# EAGLE design mkstepper (EAGLE 8.7.1)
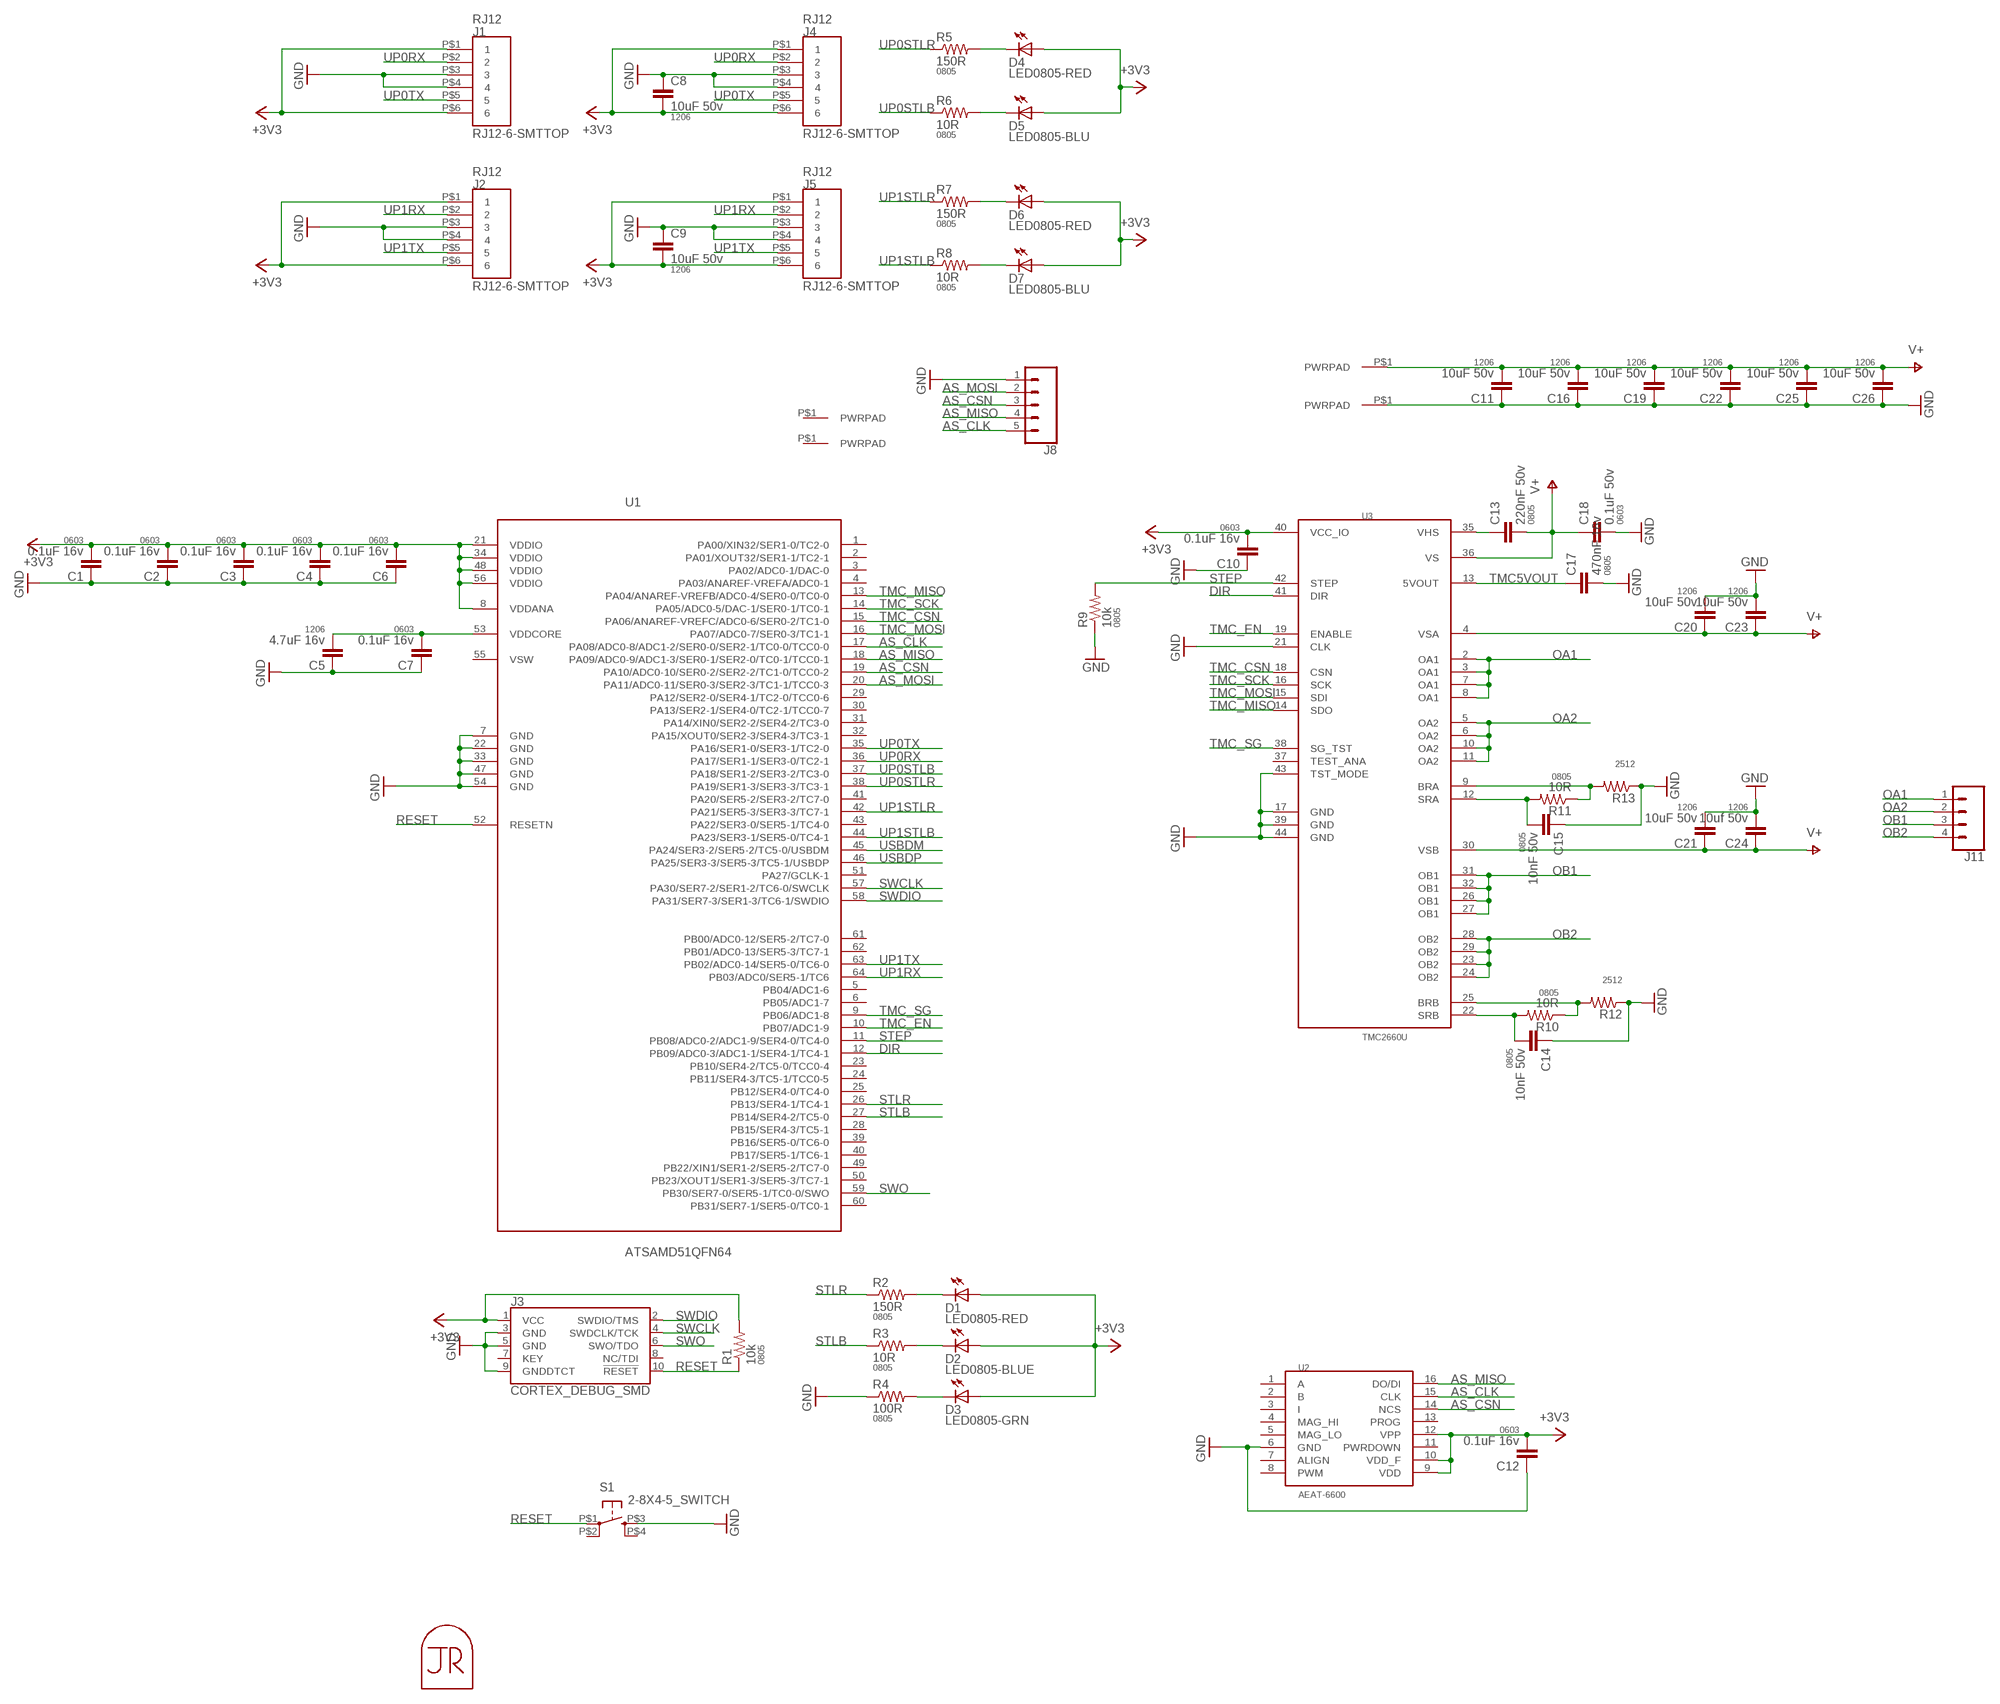
[diagram p0: schematic, sheet 1]

## Parts
C1  0.1uF 16v  CAP0603-CAP  [0603-CAP]
C2  0.1uF 16v  CAP0603-CAP  [0603-CAP]
C3  0.1uF 16v  CAP0603-CAP  [0603-CAP]
C4  0.1uF 16v  CAP0603-CAP  [0603-CAP]
C5  4.7uF 16v  CAP1206  [1206]
C6  0.1uF 16v  CAP0603-CAP  [0603-CAP]
C7  0.1uF 16v  CAP0603-CAP  [0603-CAP]
C8  10uF 50v  CAP1206  [1206]
C9  10uF 50v  CAP1206  [1206]
C10  0.1uF 16v  CAP0603-CAP  [0603-CAP]
C11  10uF 50v  CAP1206  [1206]
C12  0.1uF 16v  CAP0603-CAP  [0603-CAP]
C13  220nF 50v  CAP0805  [0805]
C14  10nF 50v  CAP0805  [0805]
C15  10nF 50v  CAP0805  [0805]
C16  10uF 50v  CAP1206  [1206]
C17  470nF 16v  CAP0805  [0805]
C18  0.1uF 50v  CAP0603-CAP  [0603-CAP]
C19  10uF 50v  CAP1206  [1206]
C20  10uF 50v  CAP1206  [1206]
C21  10uF 50v  CAP1206  [1206]
C22  10uF 50v  CAP1206  [1206]
C23  10uF 50v  CAP1206  [1206]
C24  10uf 50v  CAP1206  [1206]
C25  10uF 50v  CAP1206  [1206]
C26  10uF 50v  CAP1206  [1206]
D1  LED0805-RED  LED0805  [LED0805]
D2  LED0805-BLUE  LED0805  [LED0805]
D3  LED0805-GRN  LED0805  [LED0805]
D4  LED0805-RED  LED0805  [LED0805]
D5  LED0805-BLU  LED0805  [LED0805]
D6  LED0805-RED  LED0805  [LED0805]
D7  LED0805-BLU  LED0805  [LED0805]
J1  RJ12-6-SMTTOP  [RJ12-6-SMT-TOPENTRY]
J2  RJ12-6-SMTTOP  [RJ12-6-SMT-TOPENTRY]
J3  CORTEX_DEBUG_SMD  [SAMTECH_FTSH-105-01]
J4  RJ12-6-SMTTOP  [RJ12-6-SMT-TOPENTRY]
J5  RJ12-6-SMTTOP  [RJ12-6-SMT-TOPENTRY]
J6  PWRPADM3  [PWRPAD_3-25MM]
J7  PWRPADM3  [PWRPAD_3-25MM]
J8  CONN_05NO_SILK  [1X05_NO_SILK]
J9  PWRPAD  [PWRPAD_M3-PEM-MOUNT]
J10  PWRPAD  [PWRPAD_M3-PEM-MOUNT]
J11  CONN_04LONGPADS  [1X04_LONGPADS]
MP1  JRTOMBSTONE  [JRTOMBSTONE]
R1  10k  RESISTOR0805-RES  [0805]
R2  150R  RESISTOR0805-RES  [0805]
R3  10R  RESISTOR0805-RES  [0805]
R4  100R  RESISTOR0805-RES  [0805]
R5  150R  RESISTOR0805-RES  [0805]
R6  10R  RESISTOR0805-RES  [0805]
R7  150R  RESISTOR0805-RES  [0805]
R8  10R  RESISTOR0805-RES  [0805]
R9  10k  RESISTOR0805-RES  [0805]
R10  10R  RESISTOR0805-RES  [0805]
R11  10R  RESISTOR0805-RES  [0805]
R12  RESISTOR2512  [R2512]
R13  RESISTOR2512  [R2512]
S1  2-8X4-5_SWITCH  [TACT-SWITCH-KMR6]
U1  ATSAMD51QFN64  [QFN-64-9X9MM]
U2  AEAT-6600  [TSSOP16]
U3  TMC2660U  [TQFP44]

## Nets
+3V3: C1.2 C2.2 C3.2 C4.2 C6.2 C8.2 C9.2 C10.2 C12.2 D1.1(A) D2.1(A) D3.1(A) D4.1(A) D5.1(A) D6.1(A) D7.1(A) J1.P$1 J1.P$6 J2.P$1 J2.P$6 J3.1(VCC) J4.P$1 J4.P$6 J5.P$1 J5.P$6 R1.2 U1.8(VDDANA) U1.21(VDDIO) U1.34(VDDIO) U1.48(VDDIO) U1.56(VDDIO) U2.9(VDD) U2.10(VDD_F) U2.12(VPP) U3.40(VCC_IO)
AS_CLK: J8.5 U1.17(PA08/ADC0-8/ADC1-2/SER0-0/SER2-1/TC0-0/TCC0-0) U2.15(CLK)
AS_CSN: J8.3 U1.19(PA10/ADC0-10/SER0-2/SER2-2/TC1-0/TCC0-2) U2.14(NCS)
AS_MISO: J8.4 U1.18(PA09/ADC0-9/ADC1-3/SER0-1/SER2-0/TC0-1/TCC0-1) U2.16(DO/DI)
AS_MOSI: J8.2 U1.20(PA11/ADC0-11/SER0-3/SER2-3/TC1-1/TCC0-3)
BRA: R11.1 R13.2 U3.9(BRA)
BRB: R10.1 R12.2 U3.25(BRB)
DIR: U1.12(PB09/ADC0-3/ADC1-1/SER4-1/TC4-1) U3.41(DIR)
GND: C1.1 C2.1 C3.1 C4.1 C5.1 C6.1 C7.1 C8.1 C9.1 C10.1 C11.1 C12.1 C14.1 C15.1 C16.1 C17.2 C18.2 C19.1 C20.2 C21.2 C22.1 C23.2 C24.2 C25.1 C26.1 J1.P$3 J1.P$4 J2.P$3 J2.P$4 J3.3(GND) J3.5(GND) J3.9(GNDDTCT) J4.P$3 J4.P$4 J5.P$3 J5.P$4 J8.1 J10.P$1(PWRPAD) R4.1 R9.1 R12.1 R13.1 S1.P$3(S) U1.7(GND) U1.22(GND) U1.33(GND) U1.47(GND) U1.54(GND) U2.6(GND) U3.17(GND) U3.21(CLK) U3.39(GND) U3.43(TST_MODE) U3.44(GND)
N$1: D3.2(C) R4.2
N$2: C13.1 U3.35(VHS)
N$5: D2.2(C) R3.2
N$6: D1.2(C) R2.2
N$7: C5.2 C7.2 U1.53(VDDCORE)
N$10: D4.2(C) R5.2
N$11: D5.2(C) R6.2
N$13: D6.2(C) R7.2
N$14: D7.2(C) R8.2
OA1: J11.1 U3.2(OA1) U3.3(OA1) U3.7(OA1) U3.8(OA1)
OA2: J11.2 U3.5(OA2) U3.6(OA2) U3.10(OA2) U3.11(OA2)
OB1: J11.3 U3.26(OB1) U3.27(OB1) U3.31(OB1) U3.32(OB1)
OB2: J11.4 U3.23(OB2) U3.24(OB2) U3.28(OB2) U3.29(OB2)
RESET: J3.10(!RESET) R1.1 S1.P$1(P) U1.52(RESETN)
SRA: C15.2 R11.2 U3.12(SRA)
SRB: C14.2 R10.2 U3.22(SRB)
STEP: R9.2 U1.11(PB08/ADC0-2/ADC1-9/SER4-0/TC4-0) U3.42(STEP)
STLB: R3.1 U1.27(PB14/SER4-2/TC5-0)
STLR: R2.1 U1.26(PB13/SER4-1/TC4-1)
SWCLK: J3.4(SWDCLK/TCK) U1.57(PA30/SER7-2/SER1-2/TC6-0/SWCLK)
SWDIO: J3.2(SWDIO/TMS) U1.58(PA31/SER7-3/SER1-3/TC6-1/SWDIO)
SWO: J3.6(SWO/TDO) U1.59(PB30/SER7-0/SER5-1/TC0-0/SWO)
TMC5VOUT: C17.1 U3.13(5VOUT)
TMC_CSN: U1.15(PA06/ANAREF-VREFC/ADC0-6/SER0-2/TC1-0) U3.18(CSN)
TMC_EN: U1.10(PB07/ADC1-9) U3.19(ENABLE)
TMC_MISO: U1.13(PA04/ANAREF-VREFB/ADC0-4/SER0-0/TC0-0) U3.14(SDO)
TMC_MOSI: U1.16(PA07/ADC0-7/SER0-3/TC1-1) U3.15(SDI)
TMC_SCK: U1.14(PA05/ADC0-5/DAC-1/SER0-1/TC0-1) U3.16(SCK)
TMC_SG: U1.9(PB06/ADC1-8) U3.38(SG_TST)
UP0RX: J1.P$2 J4.P$2 U1.36(PA17/SER1-1/SER3-0/TC2-1)
UP0STLB: R6.1 U1.37(PA18/SER1-2/SER3-2/TC3-0)
UP0STLR: R5.1 U1.38(PA19/SER1-3/SER3-3/TC3-1)
UP0TX: J1.P$5 J4.P$5 U1.35(PA16/SER1-0/SER3-1/TC2-0)
UP1RX: J2.P$2 J5.P$2 U1.64(PB03/ADC0/SER5-1/TC6)
UP1STLB: R8.1 U1.44(PA23/SER3-1/SER5-0/TC4-1)
UP1STLR: R7.1 U1.42(PA21/SER5-3/SER3-3/TC7-1)
UP1TX: J2.P$5 J5.P$5 U1.63(PB02/ADC0-14/SER5-0/TC6-0)
USBDM: U1.45(PA24/SER3-2/SER5-2/TC5-0/USBDM)
USBDP: U1.46(PA25/SER3-3/SER5-3/TC5-1/USBDP)
V+: C11.2 C13.2 C16.2 C18.1 C19.2 C20.1 C21.1 C22.2 C23.1 C24.1 C25.2 C26.2 J9.P$1(PWRPAD) U3.4(VSA) U3.30(VSB) U3.36(VS)
Unconnected: J3.7(KEY) J3.8(NC/TDI) J6.P$1(PWRPAD) J7.P$1(PWRPAD) S1.P$2(P1) S1.P$4(S1) U1.1(PA00/XIN32/SER1-0/TC2-0) U1.2(PA01/XOUT32/SER1-1/TC2-1) U1.3(PA02/ADC0-1/DAC-0) U1.4(PA03/ANAREF-VREFA/ADC0-1) U1.5(PB04/ADC1-6) U1.6(PB05/ADC1-7) U1.23(PB10/SER4-2/TC5-0/TCC0-4) U1.24(PB11/SER4-3/TC5-1/TCC0-5) U1.25(PB12/SER4-0/TC4-0) U1.28(PB15/SER4-3/TC5-1) U1.29(PA12/SER2-0/SER4-1/TC2-0/TCC0-6) U1.30(PA13/SER2-1/SER4-0/TC2-1/TCC0-7) U1.31(PA14/XIN0/SER2-2/SER4-2/TC3-0) U1.32(PA15/XOUT0/SER2-3/SER4-3/TC3-1) U1.39(PB16/SER5-0/TC6-0) U1.40(PB17/SER5-1/TC6-1) U1.41(PA20/SER5-2/SER3-2/TC7-0) U1.43(PA22/SER3-0/SER5-1/TC4-0) U1.49(PB22/XIN1/SER1-2/SER5-2/TC7-0) U1.50(PB23/XOUT1/SER1-3/SER5-3/TC7-1) U1.51(PA27/GCLK-1) U1.55(VSW) U1.60(PB31/SER7-1/SER5-0/TC0-1) U1.61(PB00/ADC0-12/SER5-2/TC7-0) U1.62(PB01/ADC0-13/SER5-3/TC7-1) U2.1(A) U2.2(B) U2.3(I) U2.4(MAG_HI) U2.5(MAG_LO) U2.7(ALIGN) U2.8(PWM) U2.11(PWRDOWN) U2.13(PROG) U3.37(TEST_ANA)

## Library data of the parts
C1-C4 C6 C7 C10 C12 C18 = borkedlabs-passives:CAP: Capacitor Standard 0603 ceramic capacitor, and 0.1" leaded capacitor.; PACKAGE: 0603
C5 C8 C9 C11 C16 C19-C26 = borkedlabs-passives:CAP: Capacitor Standard 0603 ceramic capacitor, and 0.1" leaded capacitor.; PACKAGE: 1206
C13-C15 C17 = borkedlabs-passives:CAP: Capacitor Standard 0603 ceramic capacitor, and 0.1" leaded capacitor.; PACKAGE: 0805
D1-D7 = lights:LED: LED
J1 J2 J4 J5 = connector:RJ12-6-SMT
J3 = SparkFun-Connectors:CORTEX_DEBUG: Cortex Debug Connector - 10 pin Supports JTAG debug, Serial Wire debug, and Serial Wire Viewer. PTH and SMD connector options available. General Connector Information <http://infocenter.arm.com/help/topic/com.arm.doc.faqs/attached/13634/cortex_debug_connectors.pdf> Products: PTH Connector <http://www.digikey.com/product-detail/en/cnc-tech/3220-10-0100-00/1175-1627-ND/3883661> -via Digi-Key SparkFun PSoc <https://www.sparkfun.com/products/13229> SparkFun T <https://www.sparkfun.com/products/13810>
J6 J7 J9 J10 = power:PWRPAD
J8 = SparkFun-Connectors:CONN_05: Multi connection point. Often used as Generic Header-pin footprint for 0.1 inch spaced/style header connections On any of the 0.1 inch spaced packages, you can populate with these: Break Away Headers - Straight <https://www.sparkfun.com/products/116> (PRT-00116) Break Away Male Headers - Right Angle <https://www.sparkfun.com/products/553> (PRT-00553) Female Headers <https://www.sparkfun.com/products/115> (PRT-00115) Break Away Headers - Machine Pin <https://www.sparkfun.com/products/117> (PRT-00117) Break Away Female Headers - Swiss Machine Pin <https://www.sparkfun.com/products/743> (PRT-00743) For SCREWTERMINALS and SPRING TERMINALS visit here: Screw Terimnals on SparkFun.com <https://www.sparkfun.com/search/results?term=Screw+Terminals> (5mm/3.5mm/2.54mm spacing) This device is also useful as a general connection point to wire up your design to another part of your project. Our various solder wires solder well into these plated through hole pads. Hook-Up Wire - Assortment (Stranded, 22 AWG) <https://www.sparkfun.com/products/11375> (PRT-11375) Hook-Up Wire - Assortment (Solid Core, 22 AWG) <https://www.sparkfun.com/products/11367> (PRT-11367) View the entire wire category on our website here <https://www.sparkfun.com/categories/141> Special notes: Molex polarized connector foot print use with SKU : PRT-08231 with associated crimp pins and housings. 1MM SMD Version SKU: PRT-10208
J11 = SparkFun-Connectors:CONN_04: Multi connection point. Often used as Generic Header-pin footprint for 0.1 inch spaced/style header connections On any of the 0.1 inch spaced packages, you can populate with these: Break Away Headers - Straight <https://www.sparkfun.com/products/116> (PRT-00116) Break Away Male Headers - Right Angle <https://www.sparkfun.com/products/553> (PRT-00553) Female Headers <https://www.sparkfun.com/products/115> (PRT-00115) Break Away Headers - Machine Pin <https://www.sparkfun.com/products/117> (PRT-00117) Break Away Female Headers - Swiss Machine Pin <https://www.sparkfun.com/products/743> (PRT-00743) For SCREWTERMINALS and SPRING TERMINALS visit here: Screw Terimnals on SparkFun.com <https://www.sparkfun.com/search/results?term=Screw+Terminals> (5mm/3.5mm/2.54mm spacing) This device is also useful as a general connection point to wire up your design to another part of your project. Our various solder wires solder well into these plated through hole pads. Hook-Up Wire - Assortment (Stranded, 22 AWG) <https://www.sparkfun.com/products/11375> (PRT-11375) Hook-Up Wire - Assortment (Solid Core, 22 AWG) <https://www.sparkfun.com/products/11367> (PRT-11367) View the entire wire category on our website here <https://www.sparkfun.com/categories/141> Special notes: Molex polarized connector foot print use with SKU : PRT-08231 with associated crimp pins and housings. 1MM SMD Version SKU: PRT-10208; PROD_ID: CONN-09696
MP1 = connector:JRTOMBSTONE
R1-R11 = borkedlabs-passives:RESISTOR: Resistor Basic schematic elements and footprints for 0603, 1206, and PTH resistors.; PACKAGE: 0805
R12 R13 = borkedlabs-passives:RESISTOR: Resistor Basic schematic elements and footprints for 0603, 1206, and PTH resistors.; PACKAGE: 2512
S1 = fab:2-8X4-5_SWITCH
U1 = atsam:ATSAMD51
U2 = sensor:AEAT-6600
U3 = power:TMC2660

## Board
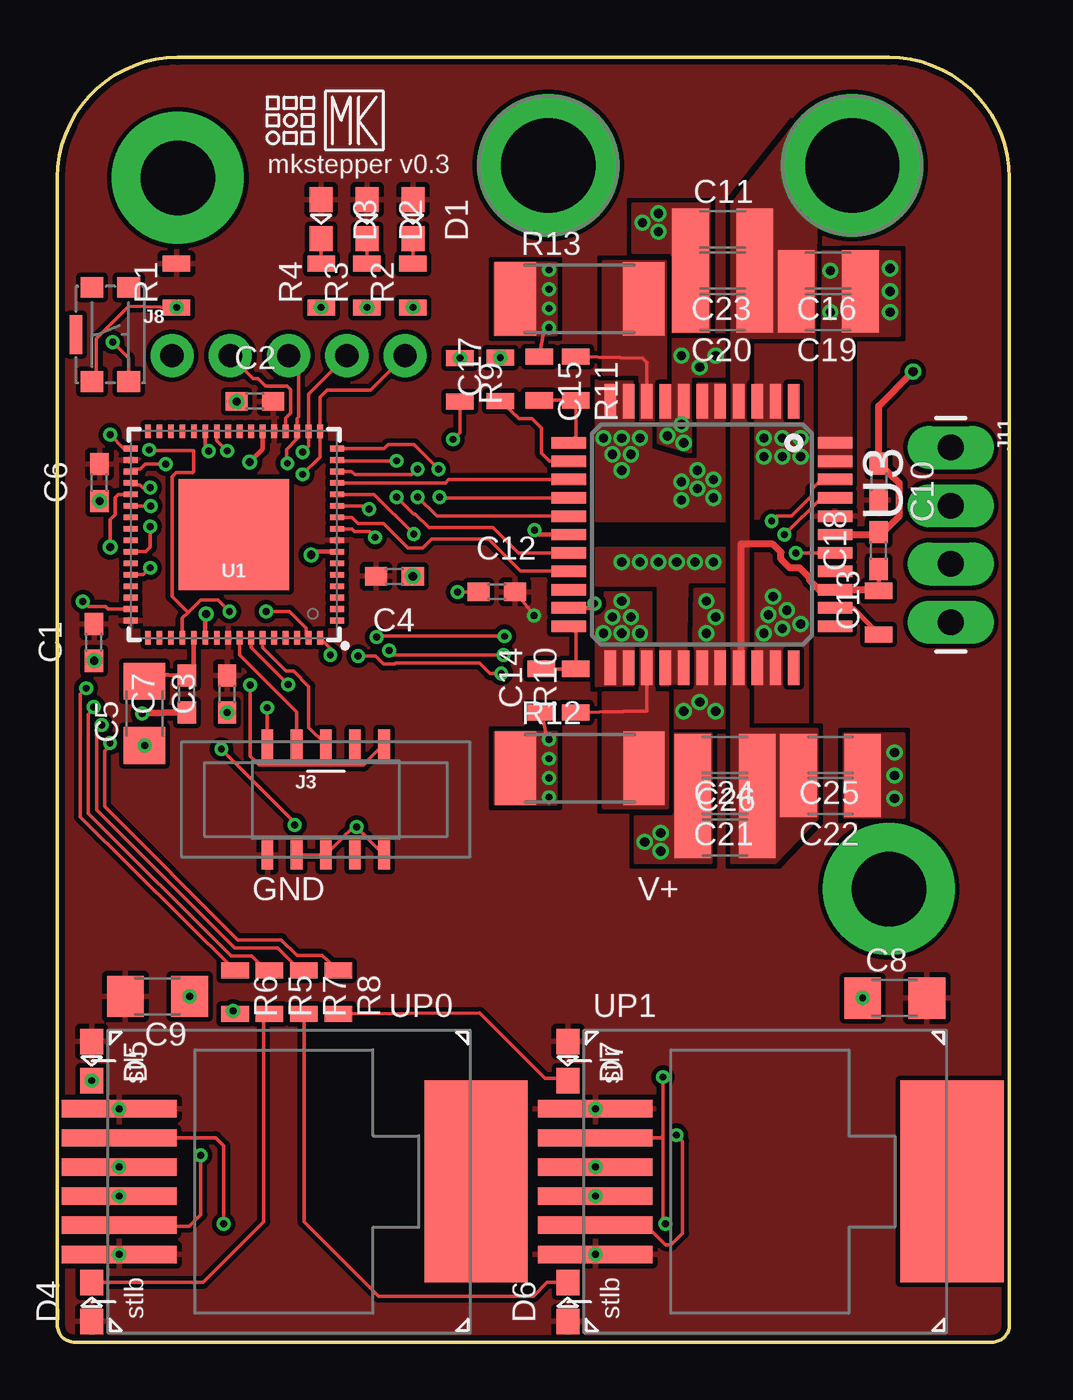
[diagram p1: board, top side]
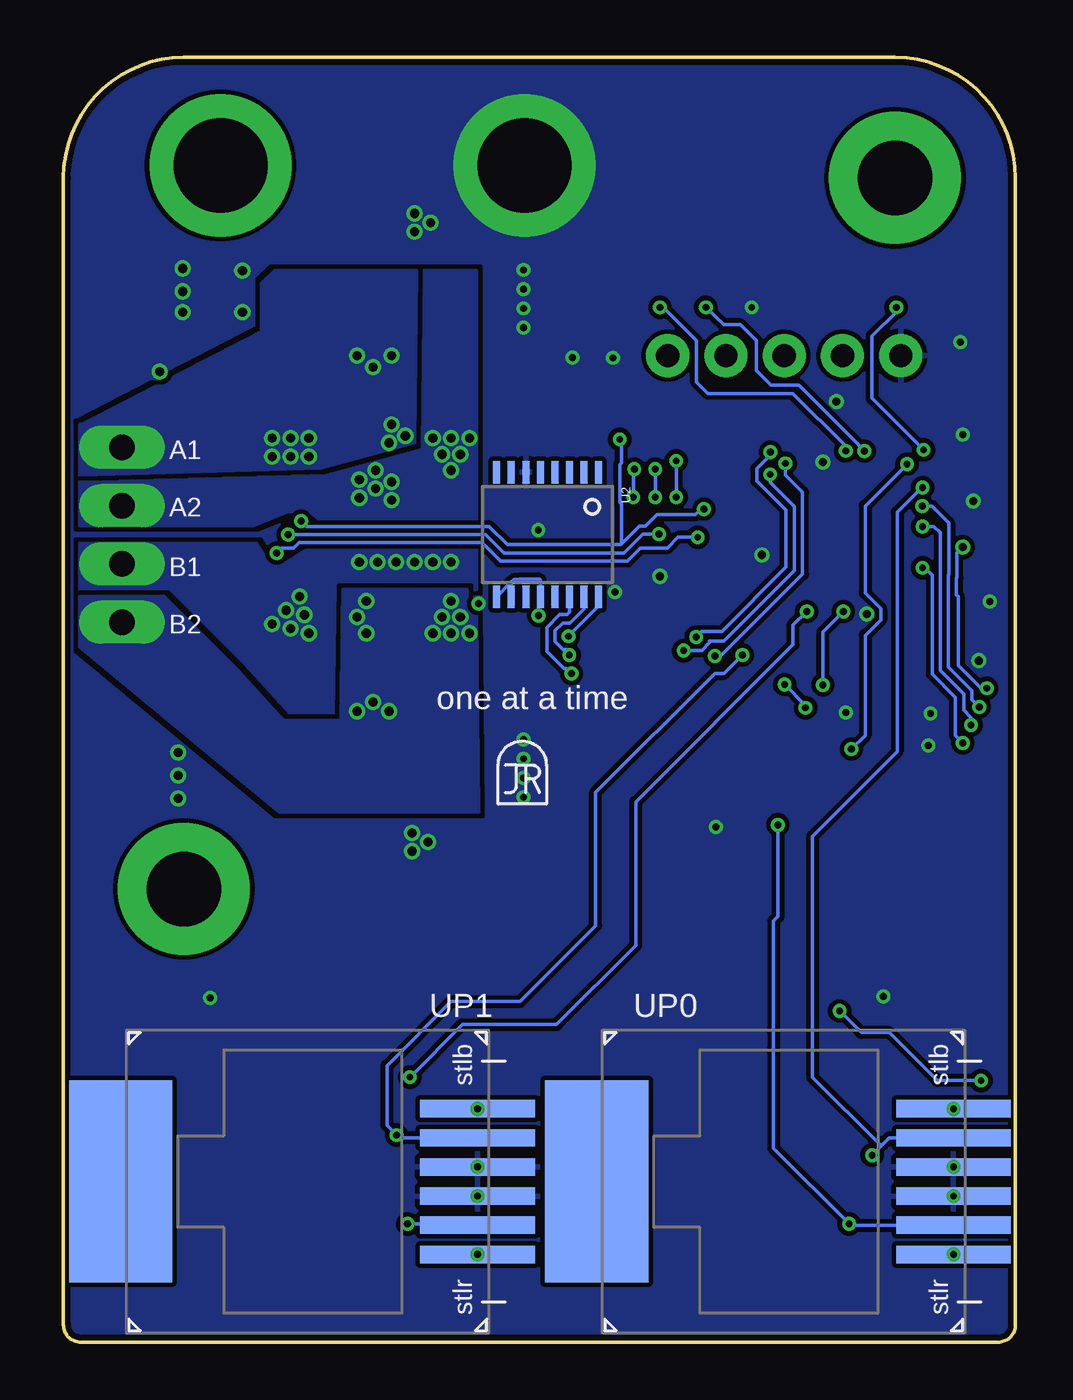
[diagram p2: board, bottom side, seen from below]

Size 41.5 x 56 mm. Coordinates in mm from the lower left corner, seen from the top.
Outline: 0,50.75 0,0.75 arc90 0.75,0 40.75,0 arc90 41.5,0.75 41.5,50.75 arc90 36.25,56 5.25,56 arc90 0,50.75
Copper layers (1*16): Top 0.035mm / dielectric 1.5mm / Bottom 0.035mm
Design rules "default *": minimum track width 6mil, minimum drill 0.3mm, track to track 8mil, track to pad 8mil, pad to pad 8mil, via to via 8mil, smd to smd 8mil, copper to edge 10mil, drill to drill 10mil, minimum pad ring 6mil, minimum via ring 6mil, stop-mask expansion 4mil, vias tented up to drill 27mil, thermal gap 9mil

### Footprints (pad centres in the part's own frame; a part is rotated, then mirrored left to right if it is on the bottom)
0603-CAP = smd 0.96 x 0.8: 1 -0.8,0; 2 0.8,0
1206 = smd 1.6 x 1.8: 1 -1.4,0; 2 1.4,0
0805 = smd 0.7 x 1.2: 1 -0.95,0; 2 0.95,0
LED0805 = smd 1.1 x 1: 1 -0.85,0; 2 0.85,0
RJ12-6-SMT-TOPENTRY = smd 0.76 x 5: P$1 -3.175,15.3; P$2 -1.905,15.3; P$3 -0.635,15.3; P$4 0.635,15.3; P$5 1.905,15.3; P$6 3.175,15.3 | smd 8.8 x 4.5: P$7 0,-0.25
SAMTECH_FTSH-105-01 = smd 0.508 x 1.27: 1 -2.54,-2.413; 2 -2.54,2.413; 3 -1.27,-2.413; 4 -1.27,2.413; 5 0,-2.413; 6 0,2.413; 7 1.27,-2.413; 8 1.27,2.413; 9 2.54,-2.413; 10 2.54,2.413
PWRPAD_3-25MM = drill 3.25 pad 5.75: P$1 0,0
1X05_NO_SILK = drill 1.016 pad 1.88: 1 0,0; 2 2.54,0; 3 5.08,0; 4 7.62,0; 5 10.16,0
PWRPAD_M3-PEM-MOUNT = drill 4.1 pad 6.2: P$1 0,0
1X04_LONGPADS = drill 1.118 pad 1.88 long: 1 0,0; 2 2.54,0; 3 5.08,0; 4 7.62,0
R2512 = smd 1.8 x 3.2: 1 -2.8,0; 2 2.8,0
TACT-SWITCH-KMR6 = smd 0.9 x 1: P$1 -2.05,0.8; P$2 2.05,0.8; P$3 -2.05,-0.8; P$4 2.05,-0.8 | smd 1.7 x 0.55: P$5 0,1.5
QFN-64-9X9MM = smd 0.6 x 0.25: 1 -4.5,3.75; 2 -4.5,3.25; 3 -4.5,2.75; 4 -4.5,2.25; 5 -4.5,1.75; 6 -4.5,1.25; 7 -4.5,0.75; 8 -4.5,0.25; 9 -4.5,-0.25; 10 -4.5,-0.75; 11 -4.5,-1.25; 12 -4.5,-1.75; 13 -4.5,-2.25; 14 -4.5,-2.75; 15 -4.5,-3.25; 16 -4.5,-3.75; 33 4.5,-3.75; 34 4.5,-3.25; 35 4.5,-2.75; 36 4.5,-2.25; 37 4.5,-1.75; 38 4.5,-1.25; 39 4.5,-0.75; 40 4.5,-0.25; 41 4.5,0.25; 42 4.5,0.75; 43 4.5,1.25; 44 4.5,1.75; 45 4.5,2.25; 46 4.5,2.75; 47 4.5,3.25; 48 4.5,3.75 | smd 0.25 x 0.6: 17 -3.75,-4.5; 18 -3.25,-4.5; 19 -2.75,-4.5; 20 -2.25,-4.5; 21 -1.75,-4.5; 22 -1.25,-4.5; 23 -0.75,-4.5; 24 -0.25,-4.5; 25 0.25,-4.5; 26 0.75,-4.5; 27 1.25,-4.5; 28 1.75,-4.5; 29 2.25,-4.5; 30 2.75,-4.5; 31 3.25,-4.5; 32 3.75,-4.5; 49 3.75,4.5; 50 3.25,4.5; 51 2.75,4.5; 52 2.25,4.5; 53 1.75,4.5; 54 1.25,4.5; 55 0.75,4.5; 56 0.25,4.5; 57 -0.25,4.5; 58 -0.75,4.5; 59 -1.25,4.5; 60 -1.75,4.5; 61 -2.25,4.5; 62 -2.75,4.5; 63 -3.25,4.5; 64 -3.75,4.5 | smd 4.826 x 4.826: P$1 0,0
TSSOP16 = smd 0.305 x 0.991: 1 -2.53,-2.718; 2 -1.895,-2.718; 3 -1.26,-2.718; 4 -0.625,-2.718; 5 0.01,-2.718; 6 0.645,-2.718; 7 1.28,-2.718; 8 1.915,-2.718; 9 1.915,2.718; 10 1.28,2.718; 11 0.645,2.718; 12 0.01,2.718; 13 -0.625,2.718; 14 -1.26,2.718; 15 -1.895,2.718; 16 -2.53,2.718
TQFP44 = smd 1.5 x 0.5: 1 -5.8,4; 2 -5.8,3.2; 3 -5.8,2.4; 4 -5.8,1.6; 5 -5.8,0.8; 6 -5.8,0; 7 -5.8,-0.8; 8 -5.8,-1.6; 9 -5.8,-2.4; 10 -5.8,-3.2; 11 -5.8,-4; 23 5.8,-4; 24 5.8,-3.2; 25 5.8,-2.4; 26 5.8,-1.6; 27 5.8,-0.8; 28 5.8,0; 29 5.8,0.8; 30 5.8,1.6; 31 5.8,2.4; 32 5.8,3.2; 33 5.8,4 | smd 0.5 x 1.5: 12 -4,-5.8; 13 -3.2,-5.8; 14 -2.4,-5.8; 15 -1.6,-5.8; 16 -0.8,-5.8; 17 0,-5.8; 18 0.8,-5.8; 19 1.6,-5.8; 20 2.4,-5.8; 21 3.2,-5.8; 22 4,-5.8; 34 4,5.8; 35 3.2,5.8; 36 2.4,5.8; 37 1.6,5.8; 38 0.8,5.8; 39 0,5.8; 40 -0.8,5.8; 41 -1.6,5.8; 42 -2.4,5.8; 43 -3.2,5.8; 44 -4,5.8

### Placement (x,y rotation side)
C1  1.6,30.5 90 top
C2  8.61,41 0 top
C3  7.4,28.25 90 top
C4  14.7,33.38 180 top
C5  3.8,27.4 90 top
C6  1.84,37.47 90 top
C7  5.65,28.25 90 top
C8  36.5,15 0 top
C9  4.37,15.07 180 top
C10  35.8,37.5 270 top
C11  29,48.5 0 top
C12  19.15,32.7 0 top
C13  35.8,31.8 90 top
C14  21.1,28.4 90 top
C15  21,42 270 top
C16  33.6,46.7 180 top
C17  19.31,41.96 90 top
C18  35.8,34.5 90 top
C19  33.6,44.9 180 top
C20  29,44.9 180 top
C21  29.1,23.8 180 top
C22  33.7,23.8 180 top
C23  29,46.7 180 top
C24  29.1,25.6 180 top
C25  33.7,25.6 180 top
C26  29.1,22 0 top
D1  15.5,48.95 270 top
D2  13.5,48.95 270 top
D3  11.5,48.95 270 top
D4  1.5,1.75 90 top
D5  1.5,12.25 270 top
D6  22.25,1.75 90 top
D7  22.25,12.25 270 top
J1  18,7 90 top
J2  38.75,7 90 top
J3  11.7,23.65 0 top
J4  18,7 270 bottom
J5  38.75,7 270 bottom
J6  5.25,50.75 0 top
J7  36.25,19.75 0 top
J8  5,43 0 top
J9  34.65,51.29 0 top
J10  21.4,51.29 0 top
J11  38.95,39 270 top
MP1  21.45,24.45 0 bottom
R1  5.2,46.05 90 top
R2  15.5,46.05 90 top
R3  13.5,46.05 90 top
R4  11.5,46.05 90 top
R5  9.25,15.25 270 top
R6  7.75,15.25 270 top
R7  10.75,15.25 270 top
R8  12.25,15.25 270 top
R9  17.55,41.95 270 top
R10  22.6,28.4 90 top
R11  22.6,42 270 top
R12  22.77,25.01 0 top
R13  22.76,45.47 0 top
S1  2.31,43.92 90 top
U1  7.7,35.2 180 top
U2  20.7,35.2 180 bottom
U3  28.1,35.2 270 top
U$5  [CBA-SILK-LOGO]  10.15,53.25 90 top
U$9  [MK-LOGO-SILK]  12.95,53.25 0 top

### Tracks (layer width: path | path; a pad name or v marks a point on that pad's centre or on a via)
+3V3  (via drill 0.3)
  Top 0.152: C12.2 20.93,31.52
  Bottom 0.152: 21.98,33.12 21.85,33.25 21.62,33.25 21.61,33.26 20.76,33.26 20.71,33.21 U2.12 20.79,32.41 v20.79,31.68 | 21.98,33.12 U2.10 | 21.98,33.12 U2.9
  other vias: 2.7,10.18 2.7,3.83 23.45,3.83 23.45,10.18
  pour Top (rank 6): 0,56.25 0,0 41.5,0 41.5,56.25
AS_CLK  (via drill 0.3)
  Top 0.152: v10.69,37.83 11.45,38.58 U1.17 11.45,41.2 11.75,41.5 13.66,41.5 J8.5 | v19.45,29.95 14.65,29.95 v14.46,30.14
  Bottom 0.152: v10.69,37.83 10.69,37.46 9.64,36.41 9.64,33.63 12.72,30.55 13.34,30.55 13.34,30.5 13.68,30.16 14.44,30.16 v14.46,30.14 | v19.45,29.95 19.45,30.08 19.56,30.19 19.73,30.19 20.07,30.53 20.07,31.01 19.73,31.35 19.41,31.35 18.8,31.95 U2.15
AS_CSN  (via drill 0.3, 0.3 pad 0.42)
  Top 0.152: v10.03,38.3 9.99,38.35 9.99,38.91 10.45,39.38 U1.19 10.45,40.26 10.53,40.34 10.53,42.55 J8.3 | v19.35,29.14 18.86,29.14 18.41,29.59 14.74,29.59 14.7,29.56 14.22,29.56 13.87,29.91 v13.11,29.91
  Bottom 0.152: v10.03,38.3 10.03,37.79 9.29,37.05 9.29,33.48 12.86,29.91 v13.11,29.91 | v19.35,29.14 19.58,29.37 19.69,29.37 20.43,30.1 20.43,31.16 19.88,31.71 19.56,31.71 19.44,31.82 U2.14
AS_MISO  (via drill 0.3)
  Top 0.152: v10.69,38.79 10.95,39.05 U1.18 10.95,41.33 J8.4 | v19.49,30.77 13.95,30.77 v13.92,30.74
  Bottom 0.152: v10.69,38.79 10.69,38.66 11.28,38.07 11.28,37.54 10,36.26 10,33.77 12.81,30.96 13.69,30.96 v13.92,30.74 | v19.49,30.77 18.55,31.71 18.54,31.71 18.17,32.07 U2.16
AS_MOSI
  Top 0.152: U1.20 9.95,40.27 10.17,40.49 10.17,41.52 10.01,41.68 9.07,41.68 8.75,42 8.54,42 J8.2
BRA
  Top 0.152: R11.1 25.5,42.9 25.7,42.7 U3.9
  pour Top (no thermals): 25.4,40.2 25.4,42.2 23.8,42.2 23.8,47.1 26.5,47.1 26.5,42 26,42 26,40.2
BRB
  Top 0.152: R10.1 25.7,27.5 U3.25
  pour Top (no thermals): 25.4,30.2 25.4,28.3 23.8,28.3 23.8,23.3 26.6,23.3 26.6,28.3 26,28.3 26,30.2
DIR  (via drill 0.3, 0.3 pad 0.42)
  Top 0.152: U1.12 13.81,36.95 v15.54,35.22 | U3.41 33.3,36.8 v31.7,35.2
  Top 0.2: 33.27,36.8 U3.41
  Bottom 0.152: v31.7,35.2 23.1,35.2 22.3,34.4 17.07,34.4 16.25,35.22 v15.54,35.22 | v15.54,35.22
GND  (via drill 0.3, 0.3 pad 0.42, 0.35, 0.4 pad 0.42)
  Top 0.152: v21.44,26.27 21.5,26.33 21.3,26.53 C14.1 | 21.5,44.16 v21.44,44.22 21.2,43.98 C15.1 | S1.P$3 3.11,42.89 v2.41,43.59 | U1.33 2.9,38.95 v2.3,39.55 | U1.47 2.23,31.95 2.12,32.06 1.34,32.06 v1.11,32.29 | J3.3 J3.5 12.44,21.97 12.44,21.99 12.84,22.39 13.09,22.39 | v13.05,22.45 13.05,22.43 13.09,22.39 | J3.9 13.5,21.97 13.5,21.99 13.34,22.15 13.33,22.15 13.09,22.39 | C12.1 v17.45,32.7
  Top 0.2: U3.17 21,35.2 v20.8,35.4 | U3.21 23.21,32 v23.41,32.19 | 35.75,38.4 C10.1 | 35.7,35.3 C18.2
  Top 0.203: 5.59,27.34 C7.1 | U1.54 6.45,31.69 v6.48,31.73 | U1.7 11.19,34.45 v11.05,34.32 | U1.22 8.95,38.92 v8.39,38.36
  Top 0.305: C18.2 36.1,35.4 36.66,35.95 36.66,35.96 36.7,36 36.7,37.45 C10.1 35.8,40.8 v37.3,42.3 | U3.39 35.6,35.2 35.7,35.3 | C7.1 v3.7,27.4
  Top 1.27: C24.2 C21.2 C26.1 | C19.1 C16.1 | C22.1 C25.1
  other vias: 21.44,46.73 21.44,45.06 21.44,45.9 21.44,23.75 21.44,24.59 21.44,25.43 3.8,26 1.84,36.67 7.81,41 15.5,33.38 1.6,29.7 19.31,42.91 36.5,25.7 36.5,24.7 36.5,23.7 26.3,22.2 26.3,21.4 25.6,21.8 36.3,46.8 36.3,45.8 36.3,44.9 26.2,49.2 26.2,48.4 25.5,48.8 33.7,44.9 33.7,46.7 7.4,27.45 2.7,7.63 2.7,6.37 23.45,7.63 23.45,6.37 5.77,15.07 35.1,15 11.5,45.1 17.55,42.9
  pour Top (no thermals): 19.07,47.04 21.74,47.04 21.74,43.91 19.07,43.91
  pour Top (no thermals): 19.07,26.57 21.74,26.57 21.74,23.45 19.07,23.45
  pour Top (no thermals): 34.3,26.5 36.9,26.5 36.9,22.9 34.3,22.9
  pour Top (rank 3, no thermals): 28.5,20.9 28.5,26.5 26.9,26.5 26.9,22.9 25.2,22.9 25.2,20.9
  pour Top (no thermals): 34.2,47.5 34.2,44 36.7,44 36.7,47.5
  pour Top (rank 3, no thermals): 26.8,44 28.4,44 28.4,49.6 25.1,49.6 25.1,47.5 26.8,47.5
  pour Top (rank 3, no thermals): 33.2,38.1 33.2,47.5 36.7,47.5 36.7,43.9 34.6,43.9 34.6,38.1
  pour Bottom (rank 6): 0,56 0,0 41.5,0 41.5,56
N$1
  Top 0.152: D3.2 R4.2
N$2
  Top 0.2: U3.35 34.7,32 C13.1
N$5
  Top 0.152: D2.2 R3.2
N$6
  Top 0.152: D1.2 R2.2
N$7
  Top 0.203: U1.53 5.95,29.4 C7.2 4.1,29.1 C5.2
N$10
  Top 0.152: D4.2 6.35,2.6 9,5.25 9,14.1 R5.2
N$11  (via drill 0.3)
  Top 0.152: v7.66,14.44 R6.2
  Bottom 0.152: D5.2 3.4,11.4 5.5,13.5 6.73,13.5 v7.66,14.44
  other vias: 1.5,11.4
N$13
  Top 0.152: D6.2 21.35,2.6 20.75,2 14,2 10.75,5.25 R7.2
N$14
  Top 0.152: R8.2 18.4,14.35 21.25,11.5 22.15,11.5 D7.2
OA1  (via drill 0.4 pad 0.42)
  other vias: 27.2,40 27.3,39.2 26.6,39.5 30.8,38.6 31.6,38.6 32.4,38.6 27.2,43 28.7,43 28,42.5 30.8,39.4 31.6,39.4 32.4,39.4
  pour Bottom (rank 2, no thermals): 40.8,37.8 30.3,38.1 26.2,39.2 26.1,46.7 32.3,46.7 32.85,46.15 32.85,44.05 40.7,40 40.8,40
  pour Top (rank 2, no thermals): 26.7,43.7 26.7,41.9 26.2,41.9 26.2,39.2 27.6,38.8 27.6,42.1 29.3,42.1 29.3,43.7
  pour Top (rank 2, no thermals): 30.1,43.7 30.1,38.2 30.2,35.9 32.9,36 32.9,43.7
OA2  (via drill 0.4 pad 0.42)
  other vias: 25,38.7 24.6,39.4 25.4,39.4 24.2,38.7 23.8,39.4 24.6,38 27.9,38 27.9,37.2 28.6,37.6 28.6,36.8 27.2,37.5 27.2,36.7
  pour Bottom (rank 3, no thermals): 40.8,35.6 33.2,35.6 31.7,36.2 30.8,36.2 30.3,35.8 23.5,35.8 23.5,46.7 26,46.7 26,39 30.4,37.9 40.8,37.5
  pour Top (rank 3, no thermals): 25.3,41.9 23.5,41.9 23.5,35.8 30.3,35.8 30.8,36.2 31.9,36.2 32.7,37 32.7,37.8 30.8,37.8 30,38 30,40.1 29.3,40.1 29.3,41.8 27.8,41.8 27.8,38.6 26,39.1 26,40.1 25.3,40.1
OB1  (via drill 0.4 pad 0.42)
  other vias: 26.2,34 25.4,34 24.6,34 27,34 27.8,34 28.6,34 30.8,30.9 31.6,31.1 31.2,32.5 32.4,31.3 31.8,31.9 31,31.7
  pour Bottom (rank 2, no thermals): 40.8,34.8 33.1,34.8 32.6,34 32.5,33.9 31.9,33.9 30.8,34.6 23.5,34.6 23.5,32.8 29.4,32.8 29.5,27.2 31.8,27.2 33.8,29.4 37.3,32.8 40.8,32.8
  pour Top (rank 4, no thermals): 26.2,28.6 26.2,33 23.5,33 23.5,34.6 30.8,34.6 31.9,33.9 32.7,33.9 32.7,26.8 30.1,26.8 30.1,30.4 29.4,30.4 29.5,32.8 27.7,32.8 27.6,28.6
OB2  (via drill 0.4 pad 0.42)
  other vias: 24.6,30.9 23.8,30.9 25.4,30.9 24.2,31.6 25,31.6 24.6,32.3 28.3,30.9 28.7,31.6 28.3,32.3 28,27.9 28.7,27.5 27.3,27.5
  pour Bottom (no thermals): 40.8,32.5 37.1,32.5 33.9,29.3 31.9,27.1 29.4,27.1 29.3,32.8 23.9,32.8 23.9,31.9 23.5,31.7 23.4,23.1 32.1,23.1 40.8,30.3
  pour Top (rank 5, no thermals): 25.2,28.6 25.2,30.3 26.1,30.3 26.1,32.8 23.9,32.8 23.9,31.9 23.5,31.7 23.5,28.6
  pour Top (rank 3, no thermals): 27.8,32.8 27.7,28.5 26.7,28.5 26.7,26.8 29.3,26.8 29.4,32.8
RESET  (via drill 0.3)
  Top 0.152: v7.5,31.85 7,32.35 6.25,32.35 | 6.25,32.35 | 4.1,38.8 v4.01,38.89 4.05,38.85 5.95,38.85 5.95,37.95 5.89,37.89 5.17,37.89 5,37.72 5,32.5 5.7,31.8 | R1.1 3.1,45.15 1.7,43.75 1.7,42.06 S1.P$1 | 6.25,32.35 6.23,32.33 5.7,31.8 | 5.7,31.8 5.45,31.55 U1.52 | J3.10 13.5,25.33 13.5,25.31 13.34,25.15 8.79,25.15 8.4,25.54 v8.4,28.65
  Bottom 0.152: v8.4,28.65 8.4,30.95 v7.5,31.85 | R1.1 5.2,44.9 6.25,43.85 6.25,41.14 v4.01,38.89
  other vias: 5.2,45.1
SRA
  Top 0.152: C15.2 R11.2 22.6,39.5 U3.12
SRB
  Top 0.152: C14.2 R10.2 22.6,30.9 U3.22
STEP  (via drill 0.3, 0.3 pad 0.42)
  Top 0.152: U1.11 13.45,36.45 v13.59,36.31 | 33.28,37.6 U3.42 33.3,37.6 32.87,37.17 32.87,36.87 32,36 31.36,36 v31.14,35.78 | v17.25,39.35 17.55,39.65 R9.2
  Bottom 0.152: v13.59,36.31 13.7,36.31 13.95,36.07 15.63,36.07 16.12,35.58 16.39,35.58 17.18,34.78 | 17.18,34.78 17.21,34.76 22.15,34.76 22.95,35.56 30.9,35.56 31.13,35.78 v31.14,35.78 | v17.25,39.35 17.18,39.28 17.18,38.31 17.24,38.25 17.24,36.6 17.18,36.54 17.18,34.78
STLB  (via drill 0.3)
  Top 0.152: U1.27 6.45,38.98 v6.59,38.84
  Bottom 0.152: v6.59,38.84 6.82,39.07 6.82,39.09 9.43,41.71 10.66,41.71 11.3,42.35 11.3,43.65 12,44.35 12.7,44.35 R3.1
  other vias: 13.5,45.1
STLR  (via drill 0.3)
  Top 0.152: U1.26 6.95,39.3 v7.4,38.85
  Bottom 0.152: v7.4,38.85 7.4,39.05 9.7,41.35 13.4,41.35 13.9,41.85 13.9,43.65 15.4,45.15 R2.1
  other vias: 15.5,45.1
SWCLK
  Top 0.152: U1.57 7.95,29.95 10.43,27.47 J3.4
SWDIO  (via drill 0.3)
  Top 0.152: J3.2 9.15,26.07 v9.15,27.65 | v10.06,28.66 8.45,30.27 U1.58
  Bottom 0.152: v9.15,27.65 9.15,27.75 v10.06,28.66
SWO
  Top 0.152: J3.6 10.96,26.8 10.96,28.58 10.3,29.24 9.98,29.24 8.95,30.28 U1.59
TMC5VOUT
  Top 0.152: U3.13 21.45,38.4 21.1,38.75 21.1,39.85 20.7,40.25 20.12,40.25 C17.1
TMC_CSN  (via drill 0.3)
  Top 0.152: v14.79,38.41 12.24,38.41 U1.15 | U3.18 20.1,34.4 19,35.5 16.2,35.5 15.6,36.1 15.52,36.1 v14.79,36.83
  Bottom 0.152: v14.79,36.83 v14.79,38.41
TMC_EN
  Top 0.152: U1.10 12.85,35.95 13.11,35.69 14.21,35.69 15.29,34.61 15.92,34.61 16.31,35 18.8,35 20.2,33.6 U3.19
TMC_MISO
  Top 0.152: U1.13 16.91,37.45 17.06,37.6 U3.14
TMC_MOSI  (via drill 0.3)
  Top 0.152: v16.62,38.06 v16.61,38.06 15.55,39.12 14.41,39.12 14.24,38.95 U1.16 | U3.15 16.7,36.8 v16.66,36.84
  Bottom 0.152: v16.66,36.84 16.66,38.01 v16.62,38.06
TMC_SCK  (via drill 0.3)
  Top 0.152: U1.14 12.83,37.95 12.98,37.81 15.45,37.81 v15.7,38.06 | v15.7,36.84 16.55,36 U3.16
  Bottom 0.152: v15.7,36.84 v15.7,38.06
TMC_SG  (via drill 0.3, 0.3 pad 0.42)
  Top 0.152: U1.9 12.85,35.45 12.96,35.33 13.6,35.33 v13.85,35.08 | v32.2,34.4 U3.38
  Bottom 0.152: v13.85,35.08 14.71,35.08 15.18,34.61 16.35,34.61 16.92,34.04 22.45,34.04 23.25,34.84 31.23,34.84 31.46,34.62 31.98,34.62 v32.2,34.4
UP0RX  (via drill 0.3)
  Top 0.152: J1.P$2 2.75,5.05 5.75,5.05 6.25,5.55 v6.25,8.15 | U1.36 3.3,37.35 3.62,37.35 3.72,37.25 v4.05,37.25
  Bottom 0.152: J4.P$2 5.5,8.9 5.8,8.6 | 5.8,8.6 v6.25,8.15 | v4.05,37.25 4.28,37.02 4.3,37.02 5.15,36.17 5.15,25.75 8.85,22.05 8.85,11.55 5.9,8.6 5.8,8.6
UP0STLB  (via drill 0.3, 0.35)
  Top 0.152: v1.25,28.5 1,28.25 1,22.9 R6.1 | v2.3,34.65 2.3,35.85 2.52,36.07 2.52,36.82 2.65,36.95 U1.37
  Bottom 0.152: v1.25,28.5 1.5,28.5 2.5,29.5 2.5,32.5 2.57,32.57 2.57,33.3 2.55,33.32 2.55,34.4 v2.3,34.65
UP0STLR  (via drill 0.3)
  Top 0.152: U1.38 v4.05,36.45 v4.06,36.44 | v1.58,27.69 1.58,27.58 1.36,27.36 1.36,23.05 7.57,16.83 8.47,16.83 9.14,16.15 R5.1
  Bottom 0.152: v4.06,36.44 3.64,36.44 2.91,35.71 2.91,33.46 2.92,33.45 2.92,29.42 1.9,28.4 1.9,28.01 v1.58,27.69
UP0TX  (via drill 0.3)
  Top 0.152: J1.P$5 6.89,8.9 7.25,8.55 v7.25,5.15 | U1.35 3.3,38.05 3.62,38.05 3.84,38.27 v4.72,38.27 | v7.15,25.85 10.35,22.65 v10.35,22.55
  Bottom 0.152: J4.P$5 7.2,5.09 v7.25,5.15 10.55,8.45 10.55,18.35 10.35,18.55 v10.35,22.55 | v4.72,38.27 6.55,36.44 6.55,32.65 5.88,31.98 5.88,31.48 6.55,30.8 6.55,26.45 v7.15,25.85
UP1RX  (via drill 0.3)
  Top 0.152: J2.P$2 25.66,5.09 26.5,4.25 26.75,4.25 27.25,4.75 27.25,8.76 v26.98,9.03 | v11.9,29.95 11.9,30.25 U1.64
  Bottom 0.152: J5.P$2 26.86,8.9 v26.98,9.03 | v26.98,9.03 27.4,9.45 27.4,12.05 24.6,14.85 21.6,14.85 18.3,18.15 18.3,23.95 13.1,29.15 12.7,29.15 v11.9,29.95 | v26.98,9.03
UP1STLB  (via drill 0.3)
  Top 0.152: U1.44 3.75,33.45 v4.05,33.75 | v2.29,26.12 2.29,25.99 2.07,25.77 2.07,23.34 7.87,17.54 9.76,17.54 10.45,16.85 11.55,16.85 R8.1
  Bottom 0.152: v4.05,33.75 3.95,33.75 3.63,33.44 3.63,29.13 2.61,28.1 2.61,26.44 v2.29,26.12
UP1STLR  (via drill 0.3)
  Top 0.152: R7.1 10.75,16.25 10.54,16.25 9.61,17.18 7.72,17.18 1.71,23.2 1.71,26.68 v1.94,26.91 | v4.05,35.55 4.05,34.65 3.85,34.45 U1.42
  Bottom 0.152: v1.94,26.91 1.94,27.23 2.26,27.54 2.26,28.25 3.28,29.27 3.28,35.28 3.55,35.55 v4.05,35.55
UP1TX  (via drill 0.3)
  Top 0.152: 26.4,9 v26.4,11.55 | 26.4,9 26.4,5.25 v26.5,5.15 | J2.P$5 26.3,8.9 26.4,9 | U1.63 10.85,30.8 10.85,31.12 10.12,31.85 v9.1,31.85
  Bottom 0.152: v26.4,11.55 24.1,13.85 20,13.85 16.55,17.3 16.55,23.55 9.7,30.4 9.7,31.25 v9.1,31.85 | v26.5,5.15 23.5,5.15 J5.P$5
V+
  Top 0.2: C13.2 C18.1
  Top 0.305: U3.30 29.8,29.5 29.8,34.8 29.82,34.78 31.19,34.78 31.54,34.43 31.54,34.13 31.93,33.74 32.36,33.74 32.79,33.31 32.79,33.2 33.2,32.8 U3.36 35.7,32.8 C13.2
  pour Top (no thermals): 33.1,51.9 32.2,53.1 29.4,49.6 29.4,20.9 31.3,20.9 33.1,22.8 33.1,26.7 30.1,26.7 30.1,43.8 33,43.8

### Text on the board
tPlace: mkstepper v0.3 | GND | V+ | UP0 | UP1
bPlace: A1 | A2 | B1 | B2 | one at a time | UP0 | UP1